# Altium schematic sheet I2C_Control.SchDoc: =DocumentName
size A3; Organization: ORGANIZATION; Address1: R. Aprígio Veloso, 882, Universitário; Address2: Campina Grande - PB; Address3: 58429-900; Revision: -; SheetNumber: 9; SheetTotal: 9; ENG_DATE: --/--/--; DSN_DATE: --/--/--; CHK_DATE: --/--/--; SCH_SCALE: 1:1
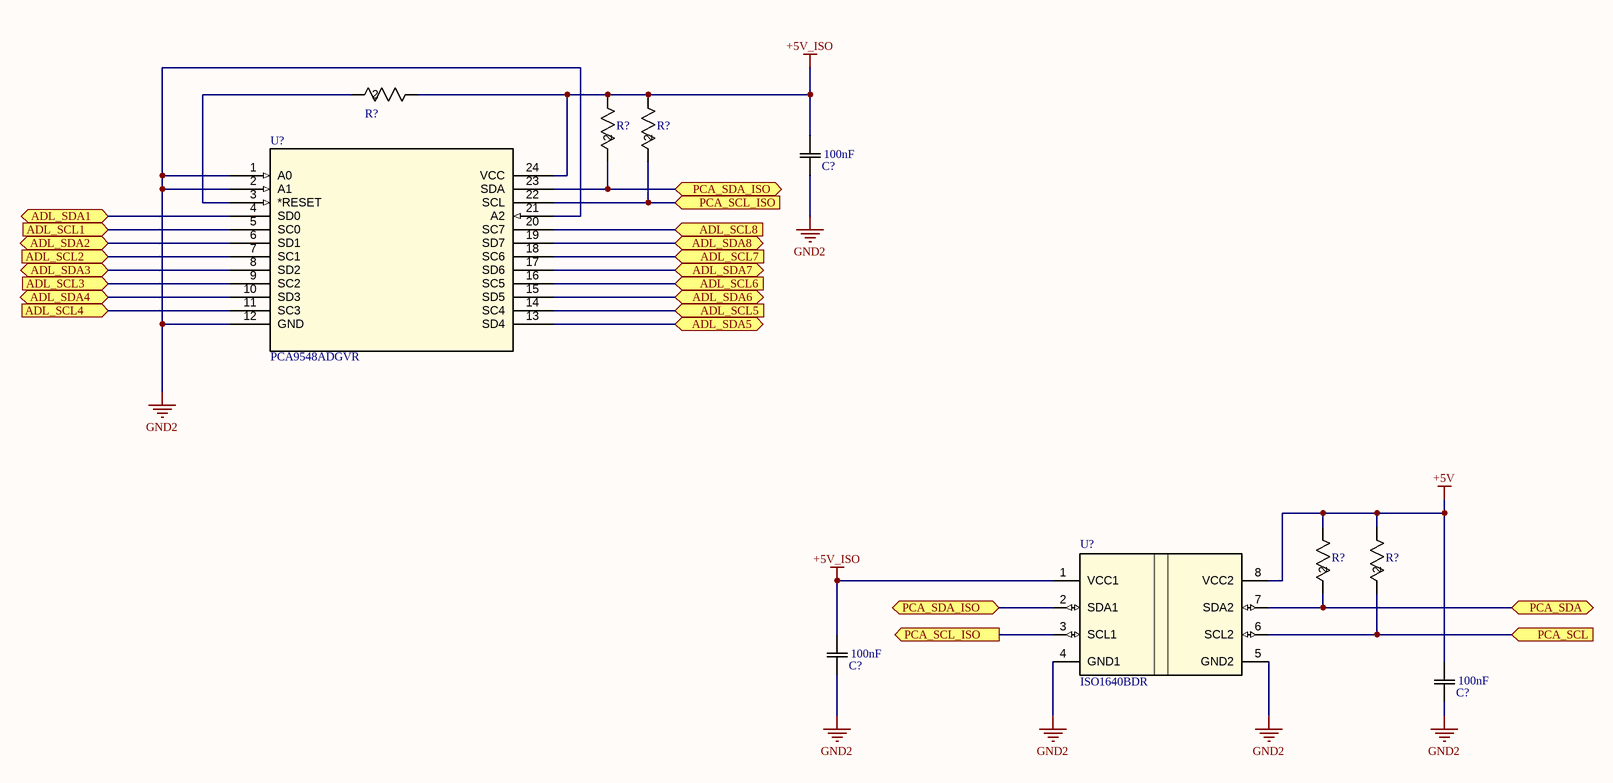
[diagram p0: I2C_Control.SchDoc]

## Parts
(Parts that share a designator on the sheet are numbered #1, #2 ... from top to bottom, then left to right.)
C?#1  value 100nF  [CAP_GCM15_MUR]  (hidden comment: GCM155R71H104KE02D)
C?#2  value 100nF  [CAP_GCM15_MUR]  (hidden comment: GCM155R71H104KE02D)
C?#3  value 100nF  [CAP_GCM15_MUR]  (hidden comment: GCM155R71H104KE02D)
R?#1  RC0402FR-075K1L  [RC0402N_YAG]  (value not drawn)
R?#2  RC0402FR-071K5L  [RC0402N_YAG]  (value not drawn)
R?#3  RC0402FR-071K5L  [RC0402N_YAG]  (value not drawn)
R?#4  RC0402FR-071K5L  [RC0402N_YAG]  (value not drawn)
R?#5  RC0402FR-071K5L  [RC0402N_YAG]  (value not drawn)
U?#1  PCA9548ADGVR  [DGV24]
U?#2  ISO1640BDR  [D0008B-IPC_A]

## Ports
ADL_SCL1 (in), ADL_SCL2 (in), ADL_SCL3 (in), ADL_SCL4 (in), ADL_SCL5 (in), ADL_SCL6 (in), ADL_SCL7 (in), ADL_SCL8 (in), ADL_SDA1 (bidir), ADL_SDA2 (bidir), ADL_SDA3 (bidir), ADL_SDA4 (bidir), ADL_SDA5 (bidir), ADL_SDA6 (bidir), ADL_SDA7 (bidir), ADL_SDA8 (bidir), PCA_SCL (in), PCA_SCL_ISO (in, see I2C_Control[4C]), PCA_SCL_ISO (out, see I2C_Control[4A]), PCA_SDA (bidir), PCA_SDA_ISO (bidir, see I2C_Control[4A]), PCA_SDA_ISO (bidir, see I2C_Control[4B])

## Nets
+5V: C?#3.2 R?#4.1 R?#5.1 U?#2.8(VCC2)
+5V_ISO: C?#1.2 C?#2.2 R?#1.1 R?#2.1 R?#3.1 U?#1.24(VCC) U?#2.1(VCC1)
GND2: C?#1.1 C?#2.1 C?#3.1 U?#1.1(A0) U?#1.2(A1) U?#1.12(GND) U?#1.21(A2) U?#2.4(GND1) U?#2.5(GND2)
ADL_SCL1: U?#1.5(SC0) ; port ADL_SCL1
ADL_SCL2: U?#1.7(SC1) ; port ADL_SCL2
ADL_SCL3: U?#1.9(SC2) ; port ADL_SCL3
ADL_SCL4: U?#1.11(SC3) ; port ADL_SCL4
ADL_SCL5: U?#1.14(SC4) ; port ADL_SCL5
ADL_SCL6: U?#1.16(SC5) ; port ADL_SCL6
ADL_SCL7: U?#1.18(SC6) ; port ADL_SCL7
ADL_SCL8: U?#1.20(SC7) ; port ADL_SCL8
ADL_SDA1: U?#1.4(SD0) ; port ADL_SDA1
ADL_SDA2: U?#1.6(SD1) ; port ADL_SDA2
ADL_SDA3: U?#1.8(SD2) ; port ADL_SDA3
ADL_SDA4: U?#1.10(SD3) ; port ADL_SDA4
ADL_SDA5: U?#1.13(SD4) ; port ADL_SDA5
ADL_SDA6: U?#1.15(SD5) ; port ADL_SDA6
ADL_SDA7: U?#1.17(SD6) ; port ADL_SDA7
ADL_SDA8: U?#1.19(SD7) ; port ADL_SDA8
PCA_SCL: R?#5.2 U?#2.6(SCL2) ; port PCA_SCL
PCA_SCL_ISO: R?#3.2 U?#1.22(SCL) U?#2.3(SCL1) ; port PCA_SCL_ISO
PCA_SDA: R?#4.2 U?#2.7(SDA2) ; port PCA_SDA
PCA_SDA_ISO: R?#2.2 U?#1.23(SDA) U?#2.2(SDA1) ; port PCA_SDA_ISO
NetR?#1_2: R?#1.2 U?#1.3(*RESET)

## Notes on the sheet
- REVISION
- DESCRIPTION
- DATE
- APPROVED
- ADDRESS
- PROJECT
- VERSION
- TITLE
- A3
- SIZE
- SCALE
- DOCUMENT NAME:
- DOCUMENT REVISION:
- OF
- SHEET:
- PROJECT REVISION:

## Library data of the parts
C?#1-C?#3 = GCM155R71H104KE02D: Description; Manufacturer_Name: Murata; Copyright: Copyright (C) 2026 Ultra Librarian. All rights reserved.; Manufacturer_Part_Number: GCM155R71H104KE02D
R?#1 = RC0402FR-075K1L: Description; Manufacturer_Name: Yageo; Value: 5.1k; Copyright: Copyright (C) 2025 Ultra Librarian. All rights reserved.; Manufacturer_Part_Number: RC0402FR-075K1L
R?#2-R?#5 = RC0402FR-071K5L: Description; Manufacturer_Name: Yageo; Copyright: Copyright (C) 2025 Ultra Librarian. All rights reserved.; Manufacturer_Part_Number: RC0402FR-071K5L
U?#1 = PCA9548ADGVR: 8-channel 2.3- to 5.5-V I2C/SMBus switch with reset & voltage translation 24-TVSOP -40 to 85; Manufacturer_Name: Texas Instruments; Copyright: Copyright (C) 2026 Ultra Librarian. All rights reserved.; Manufacturer_Part_Number: PCA9548ADGVR; RefDes: RefDes; Type: Type
U?#2 = ISO1640BDR: Hot-swappable, robust-EMC bidirectional I2C isolator with bidirectional clock 8-SOIC -40 to 125; Manufacturer_Name: Texas Instruments; TYPE: TYPE; RefDes: RefDes; Copyright: Copyright (C) 2026 Ultra Librarian. All rights reserved.; Manufacturer_Part_Number: ISO1640BDR